# EAGLE design Badge Schematic (EAGLE 7.3.0)
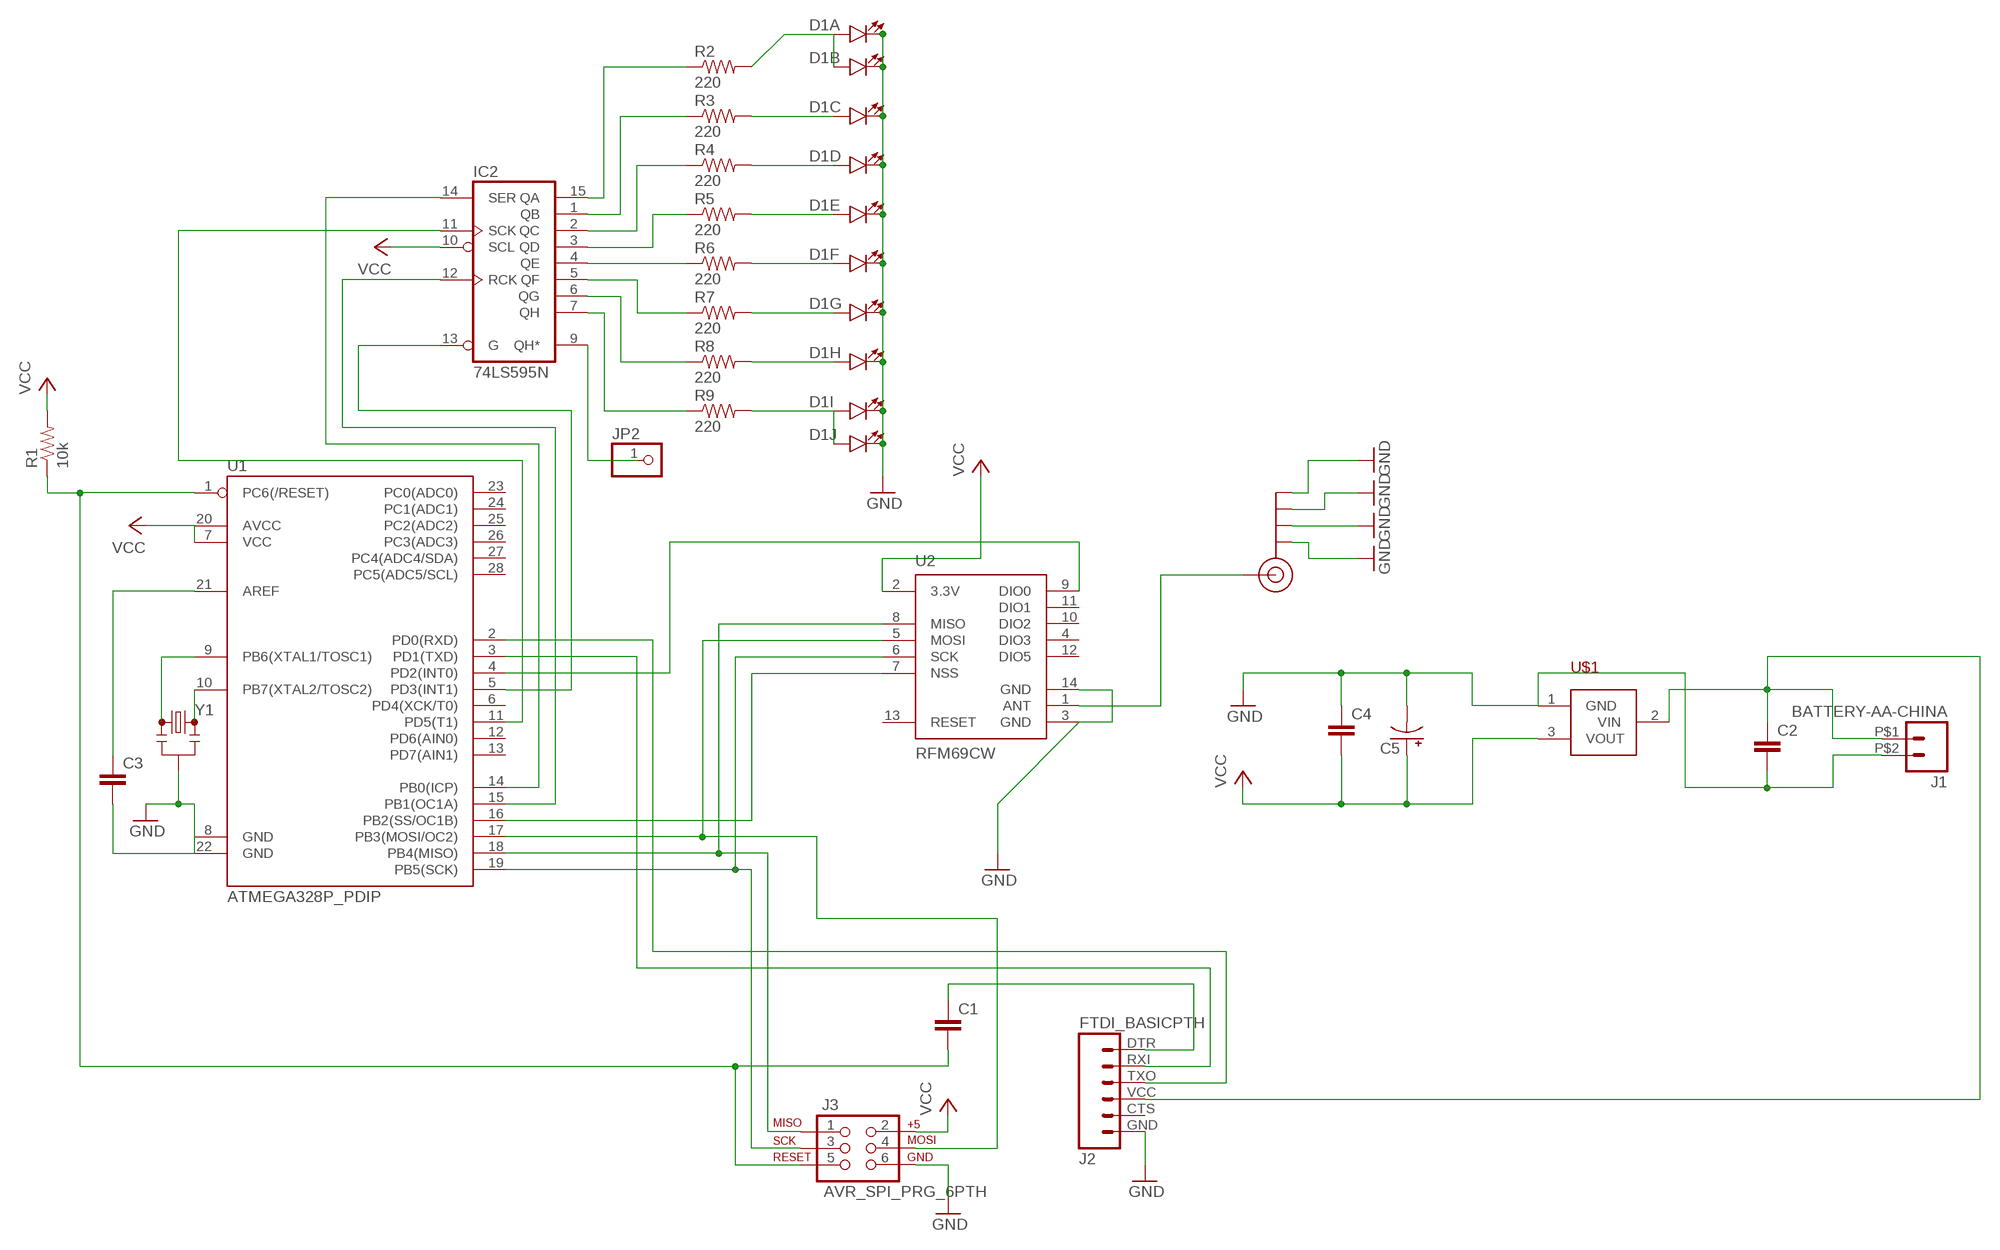
[diagram p0: schematic, sheet 1]

## Parts
C1  0.1UF-50V-20%(PTH)KIT-EZ  [CAP-PTH-SMALL-KIT]
C2  0.1UF-50V-20%(PTH)KIT-EZ  [CAP-PTH-SMALL-KIT]
C3  0.1UF-50V-20%(PTH)KIT-EZ  [CAP-PTH-SMALL-KIT]
C4  0.1UF-50V-20%(PTH)KIT-EZ  [CAP-PTH-SMALL-KIT]
C5  10UF-25V-20%(PTH)KIT  [CPOL-RADIAL-10UF-25V-KIT]
D1  LED_BARGRAPH_10  [LED_BARGAPH_10]
IC2  74LS595N  [DIL16]
J1  BATTERY-AA-CHINA  [BATTERY-AA-CHINA-PACKAGE]
J2  FTDI_BASICPTH  [FTDI_BASIC]
J3  AVR_SPI_PRG_6PTH  [2X3]
J$1  SMA_EDGE  [SMA-EDGE]
JP2  PINHD-1X1  [1X01]
R1  10k  RESISTORAXIAL-0.3  [AXIAL-0.3]
R2  220  RESISTOREZ  [AXIAL-0.3EZ]
R3  220  RESISTOREZ  [AXIAL-0.3EZ]
R4  220  RESISTOREZ  [AXIAL-0.3EZ]
R5  220  RESISTOREZ  [AXIAL-0.3EZ]
R6  220  RESISTOREZ  [AXIAL-0.3EZ]
R7  220  RESISTOREZ  [AXIAL-0.3EZ]
R8  220  RESISTOREZ  [AXIAL-0.3EZ]
R9  220  RESISTOREZ  [AXIAL-0.3EZ]
U1  ATMEGA328P_PDIP  [DIL28-3]
U2  RFM69CW  [RFM69CW-XXXS2]
U$1  MCP1702-33TO92  [TO-92]
Y1  RESONATORPTH  [RESONATOR-PTH]

## Nets
GND: C2.2 C3.2 C4.1 C5.2(-) D1.11(J:C) D1.12(I:C) D1.13(H:C) D1.14(G:C) D1.15(F:C) D1.16(E:C) D1.17(D:C) D1.18(C:C) D1.19(B:C) D1.20(A:C) J1.P$2 J2.GND J3.6 J$1.GND@0(GND) J$1.GND@1(GND) J$1.GND@2(GND) J$1.GND@3(GND) U1.8(GND) U1.22(GND) U2.3(GND) U2.14(GND) U$1.1(GND) Y1.2
N$1: J$1.SIG(SIGNAL) U2.1(ANT)
N$2: J3.4 U1.17(PB3(MOSI/OC2)) U2.5(MOSI)
N$3: J3.1 U1.18(PB4(MISO)) U2.8(MISO)
N$4: J3.3 U1.19(PB5(SCK)) U2.6(SCK)
N$5: U1.4(PD2(INT0)) U2.9(DIO0)
N$6: U1.16(PB2(SS/OC1B)) U2.7(NSS)
N$7: IC2.13(G) U1.5(PD3(INT1))
N$8: C1.1 J2.DTR
N$9: U1.10(PB7(XTAL2/TOSC2)) Y1.3
N$10: J2.TXO U1.2(PD0(RXD))
N$11: J2.RXI U1.3(PD1(TXD))
N$12: U1.9(PB6(XTAL1/TOSC1)) Y1.1
N$13: C2.1 J1.P$1 J2.VCC U$1.2(VIN)
N$14: IC2.7(QH) R9.P$1
N$15: IC2.15(QA) R2.P$1
N$16: IC2.6(QG) R8.P$1
N$17: IC2.5(QF) R7.P$1
N$18: C3.1 U1.21(AREF)
N$19: IC2.4(QE) R6.P$1
N$20: C1.2 J3.5 R1.P$1 U1.1(PC6(/RESET))
N$21: IC2.3(QD) R5.P$1
N$22: IC2.2(QC) R4.P$1
N$23: IC2.1(QB) R3.P$1
N$24: D1.1(A:A) D1.2(B:A) R2.P$2
N$25: D1.3(C:A) R3.P$2
N$26: D1.4(D:A) R4.P$2
N$27: D1.5(E:A) R5.P$2
N$28: D1.6(F:A) R6.P$2
N$29: D1.7(G:A) R7.P$2
N$30: D1.8(H:A) R8.P$2
N$31: D1.9(I:A) D1.10(J:A) R9.P$2
N$33: IC2.14(SER) U1.14(PB0(ICP))
N$34: IC2.12(RCK) U1.15(PB1(OC1A))
N$35: IC2.11(SCK) U1.11(PD5(T1))
N$36: IC2.9(QH*) JP2.1
VCC: C4.2 C5.1(+) IC2.10(SCL) J3.2 R1.P$2 U1.7(VCC) U1.20(AVCC) U2.2(3.3V) U$1.3(VOUT)
Unconnected: J2.CTS U1.6(PD4(XCK/T0)) U1.12(PD6(AIN0)) U1.13(PD7(AIN1)) U1.23(PC0(ADC0)) U1.24(PC1(ADC1)) U1.25(PC2(ADC2)) U1.26(PC3(ADC3)) U1.27(PC4(ADC4/SDA)) U1.28(PC5(ADC5/SCL)) U2.4(DIO3) U2.10(DIO2) U2.11(DIO1) U2.12(DIO5) U2.13(RESET)

## Power pins joined to a net without a drawn wire
GND: IC2.8(GND)
VCC: IC2.16(VCC)

## Library data of the parts
C1-C4 = SparkFun-Capacitors:0.1UF-50V-20%(PTH): CAP-08370; PROD_ID: CAP-08370
C5 = SparkFun-Capacitors:10UF-25V-20%(PTH): CAP-08440; PROD_ID: CAP-08440
D1 = SparkFun-LED:LED_BARGRAPH_10: 10-Segment LED Bar Graph SFE part numbers: COM-09935 (red, Vf = 2.1V, Ifmax = 20mA) COM-09936 (yellow, Vf = 2.1V, Ifmax = 20mA) COM-09937 (blue, Vf = 3.4V, Ifmax = 20mA) COM-09938 (green, Vf = 3.4V, Ifmax = 20mA)
IC2 = 74xx-us:74*595: 8-bit SHIFT REGISTER, output latch
J1 = CarolinaCon:BATTERY-AA-CHINA
J2 = SparkFun-Connectors:FTDI_BASIC: FTDI Basic header with labels
J3 = SparkFun-Connectors:AVR_SPI_PRG_6: AVR ISP 6 Pin This is the reduced ISP connector for AVR programming. Common on Arduino. This footprint will take up less PCB space and can be used with a 10-pin to 6-pin adapter such as SKU: BOB-08508 **Special note about "TEST_POINT" package. The stop mask is on the top side, so if you want your programming test points to be on the bottom of your board, make sure to place this package on the bottom side of the board. This also ensure that the orientation to program from the bottom side will be correct.
J$1 = SparkFun-Connectors:SMA_EDGE: SMA Antenna Connector End launch SMA connector. The paste layer has been removed so that the connector can be hand soldered onto the board after reflow.
JP2 = pinhead:PINHD-1X1: PIN HEADER
R1-R9 = SparkFun-Passives:RESISTOR: Resistor Basic schematic elements and footprints for 0603, 1206, and PTH resistors.
U1 = SparkFun-DigitalIC:ATMEGA328P_PDIP: uC used in the Arduino 32kb flash, 1k EEPROM, 2k SRAM This is the through-hole version of this chip.
U2 = SparkFun-RF:RFM69
U$1 = CarolinaCon:MCP1702-33
Y1 = SparkFun-FreqCtrl:RESONATOR: Resonator Small SMD resonator. Used, eg, on the Arduino Pro/ Pro Mini boards. 8MHz- XTAL-08895 16MHz- XTAL-08900

## Board
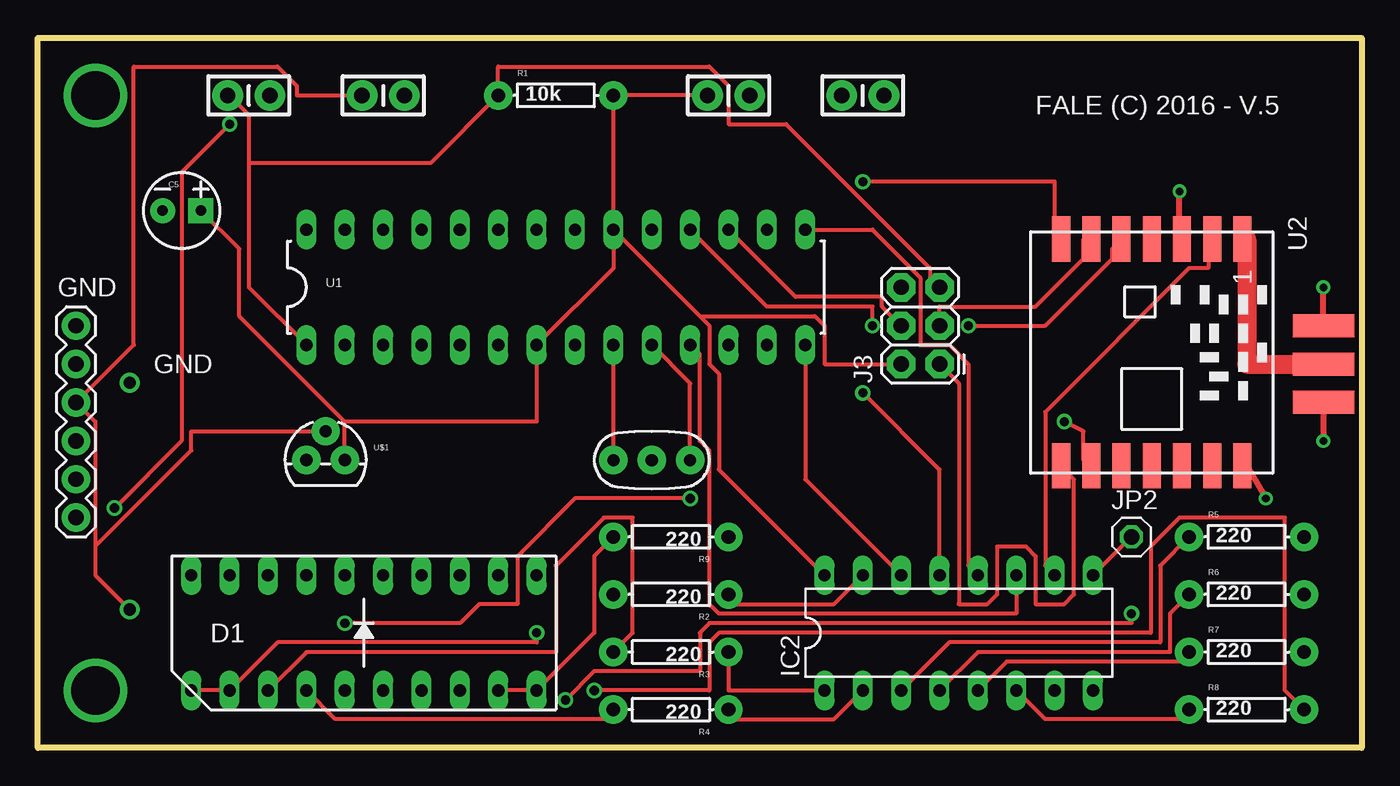
[diagram p1: board, top side]
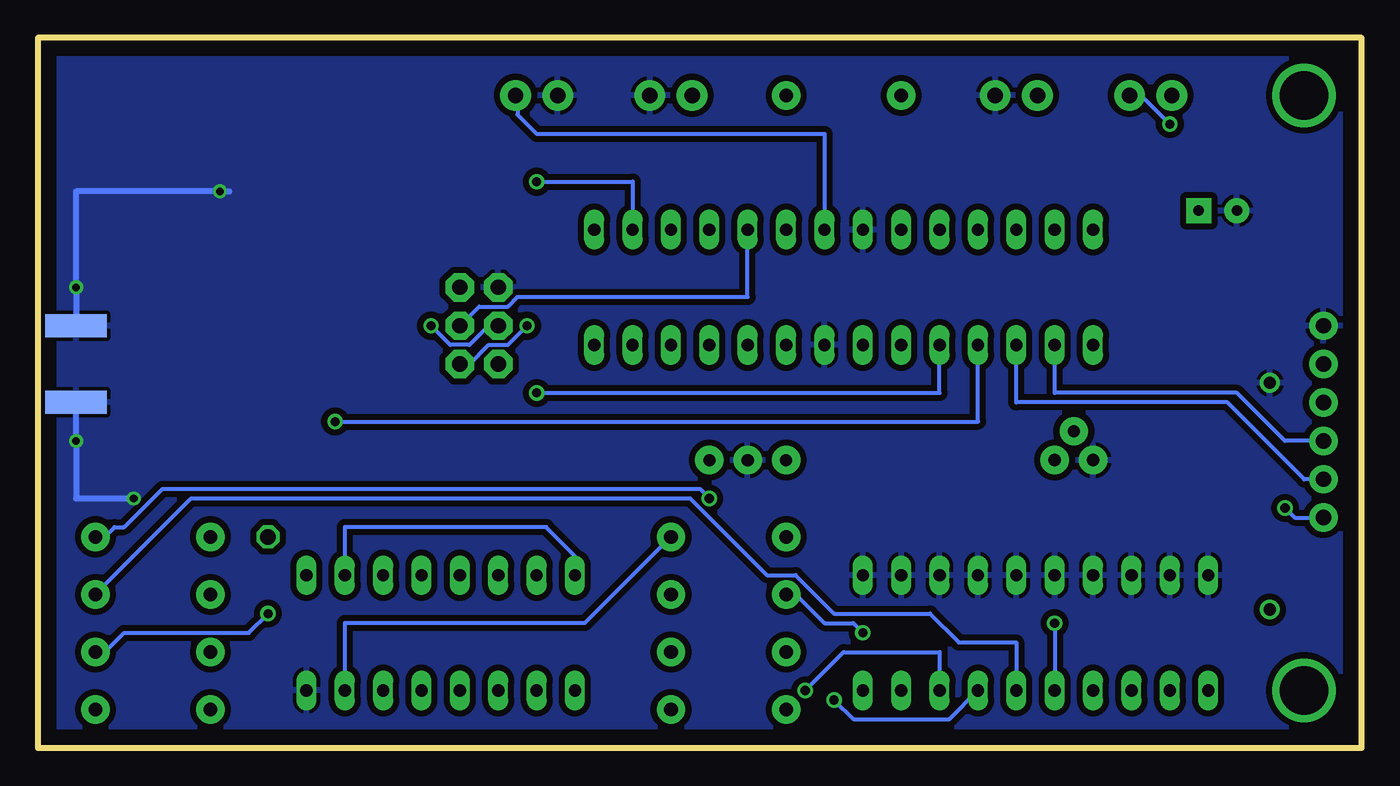
[diagram p2: board, bottom side, seen from below]

Size 87.63 x 46.99 mm. Coordinates in mm from the lower left corner, seen from the top.
Outline: 87.63,46.99 87.63,0 0,0 0,46.99 87.63,46.99
Copper layers (1*16): Top 0.035mm / dielectric 1.5mm / Bottom 0.035mm
Design rules "default": minimum track width 10mil, minimum drill 24mil, track to track 8mil, track to pad 8mil, pad to pad 8mil, via to via 8mil, smd to smd 8mil, copper to edge 40mil, drill to drill 8mil, minimum pad ring 10mil, minimum via ring 8mil, stop-mask expansion 4mil, vias tented up to drill 0mil, thermal gap 10mil

### Footprints (pad centres in the part's own frame; a part is rotated, then mirrored left to right if it is on the bottom)
CAP-PTH-SMALL-KIT = drill 1.016 pad 2.032: 1 -1.397,0; 2 1.397,0
CPOL-RADIAL-10UF-25V-KIT = drill 0.7 pad 1.651 square: 1 1.27,0 | drill 0.7 pad 1.651: 2 -1.27,0
LED_BARGAPH_10 = drill 0.813 long: 1 -11.43,-3.81; 2 -8.89,-3.81; 3 -6.35,-3.81; 4 -3.81,-3.81; 5 -1.27,-3.81; 6 1.27,-3.81; 7 3.81,-3.81; 8 6.35,-3.81; 9 8.89,-3.81; 10 11.43,-3.81; 11 11.43,3.81; 12 8.89,3.81; 13 6.35,3.81; 14 3.81,3.81; 15 1.27,3.81; 16 -1.27,3.81; 17 -3.81,3.81; 18 -6.35,3.81; 19 -8.89,3.81; 20 -11.43,3.81
DIL16 = drill 0.813 long: 1 -8.89,-3.81; 2 -6.35,-3.81; 3 -3.81,-3.81; 4 -1.27,-3.81; 5 1.27,-3.81; 6 3.81,-3.81; 7 6.35,-3.81; 8 8.89,-3.81; 9 8.89,3.81; 10 6.35,3.81; 11 3.81,3.81; 12 1.27,3.81; 13 -1.27,3.81; 14 -3.81,3.81; 15 -6.35,3.81; 16 -8.89,3.81
BATTERY-AA-CHINA-PACKAGE = drill 0.8: P$1 0,4; P$2 15,4
FTDI_BASIC = drill 1.016 pad 1.88: CTS 10.16,0; DTR 0,0; GND 12.7,0; RXI 2.54,0; TXO 5.08,0; VCC 7.62,0
2X3 = drill 1.016 pad 1.88 octagon: 1 0,0; 2 0,2.54; 3 2.54,0; 4 2.54,2.54; 5 5.08,0; 6 5.08,2.54
SMA-EDGE = smd 1.524 x 4.064: GND@0 0,0; GND@1 5.08,0; SIG 2.54,0 | smd 1.524 x 4.064 bottom: GND@2 0,0; GND@3 5.08,0
1X01 = drill 1.016 octagon: 1 0,0
AXIAL-0.3 = drill 0.9 pad 1.88: P$1 -3.81,0; P$2 3.81,0
AXIAL-0.3EZ = drill 0.9 pad 1.88: P$1 -3.81,0; P$2 3.81,0
DIL28-3 = drill 0.813 long: 1 -16.51,-3.81; 2 -13.97,-3.81; 3 -11.43,-3.81; 4 -8.89,-3.81; 5 -6.35,-3.81; 6 -3.81,-3.81; 7 -1.27,-3.81; 8 1.27,-3.81; 9 3.81,-3.81; 10 6.35,-3.81; 11 8.89,-3.81; 12 11.43,-3.81; 13 13.97,-3.81; 14 16.51,-3.81; 15 16.51,3.81; 16 13.97,3.81; 17 11.43,3.81; 18 8.89,3.81; 19 6.35,3.81; 20 3.81,3.81; 21 1.27,3.81; 22 -1.27,3.81; 23 -3.81,3.81; 24 -6.35,3.81; 25 -8.89,3.81; 26 -11.43,3.81; 27 -13.97,3.81; 28 -16.51,3.81
RFM69CW-XXXS2 = smd 3 x 1.2: 1 -7.5,6; 2 -7.5,4; 3 -7.5,2; 4 -7.5,0; 5 -7.5,-2; 6 -7.5,-4; 7 -7.5,-6; 8 7.5,-6; 9 7.5,-4; 10 7.5,-2; 11 7.5,0; 12 7.5,2; 13 7.5,4; 14 7.5,6
TO-92 = drill 0.813 pad 1.88: 1 -1.27,0; 2 0,1.905; 3 1.27,0
RESONATOR-PTH = drill 0.8 pad 1.88: 1 -2.54,0; 2 0,0; 3 2.54,0

### Placement (x,y rotation side)
C1  13.97,43.18 180 top
C2  22.86,43.18 0 top
C3  54.61,43.18 180 top
C4  45.72,43.18 180 top
C5  9.53,35.56 0 top
D1  21.59,7.62 0 top
IC2  60.96,7.62 0 top
J1  10.08,9.16 90 top
J2  2.54,15.24 90 top
J3  59.69,25.4 90 top
J$1  85.09,22.86 90 top
JP2  72.39,13.97 0 top
R1  34.29,43.18 0 top
R2  41.91,10.16 180 top
R3  41.91,6.35 180 top
R4  41.91,2.54 180 top
R5  80.01,13.97 0 top
R6  80.01,10.16 0 top
R7  80.01,6.35 0 top
R8  80.01,2.54 0 top
R9  41.91,13.97 180 top
U1  34.29,30.48 0 top
U2  73.73,26.17 270 top
U$1  19.05,19.05 0 top
Y1  40.64,19.05 0 top

### Tracks (layer width: path | path; a pad name or v marks a point on that pad's centre or on a via)
GND  (via drill 0.5)
  Top 0.406: U2.14 80.01,18.67 v81.28,16.51 | U2.3 75.56,33.67 v75.56,36.83 | J$1.GND@1 v85.09,30.48 | J$1.GND@0 v85.09,20.32
  Bottom 0.406: J$1.GND@0 v85.09,20.32 85.09,16.51 v81.28,16.51 | J$1.GND@1 v85.09,30.48 85.09,36.83 v75.56,36.83 74.93,36.83
  pour Bottom (isolate 0.406): 0,46.99 87.63,46.99 87.63,0 0,0
N$1
  Top 1.27: U2.1 80.01,33.67 80.01,25.4 J$1.SIG
N$2  (via drill 0.61)
  Top 0.254: U1.17 50.17,29.84 55.88,29.84 55.88,29.21 J3.4 | v61.59,27.94 66.67,27.94 71.12,32.38 71.12,33.02 71.75,33.66 U2.5
  Bottom 0.254: v61.59,27.94 60.33,26.67 59.05,26.67 57.78,27.94 J3.4
N$3  (via drill 0.61)
  Top 0.254: U1.18 48.26,29.21 55.24,29.21 v55.24,27.94 | J3.1 60.96,24.13 60.96,9.52 62.86,9.52 63.5,10.16 63.5,13.33 65.41,13.33 66.04,12.7 66.04,9.52 67.94,9.52 68.58,10.16 68.58,17.78 67.94,18.41 U2.8
  Bottom 0.254: v55.24,27.94 56.52,26.67 57.78,26.67 59.05,25.4 J3.1
N$4
  Top 0.254: J3.3 59.69,29.21 66.04,29.21 69.22,32.38 69.22,33.66 U2.6
  Bottom 0.254: U1.19 40.64,29.84 55.88,29.84 56.52,29.21 58.42,29.21 J3.3
N$5  (via drill 0.61)
  Top 0.254: v67.94,21.59 69.22,20.95 69.22,19.05 U2.9
  Top 0.406: U2.9 69.85,18.67
  Bottom 0.254: U1.4 25.4,21.59 v67.94,21.59
N$6  (via drill 0.61)
  Top 0.254: v54.61,37.46 67.31,37.46 67.31,34.29 U2.7
  Bottom 0.254: U1.16 48.26,37.46 v54.61,37.46
N$7  (via drill 0.61)
  Top 0.254: v54.61,23.49 59.69,18.41 IC2.13
  Bottom 0.254: U1.5 27.94,23.49 v54.61,23.49
N$8  (via drill 0.61)
  Top 0.254: v5.08,15.88 9.53,20.32 9.53,38.1 v12.7,41.27
  Bottom 0.254: J2.DTR 4.45,15.24 v5.08,15.88 | v12.7,41.27 14.61,43.18 C1.1
N$9
  Top 0.254: U1.10 43.18,24.13 Y1.3
N$10
  Bottom 0.254: U1.2 20.32,23.49 8.25,23.49 5.08,20.32 J2.TXO
N$11
  Bottom 0.254: U1.3 22.86,22.86 8.89,22.86 3.81,17.78 J2.RXI
N$12
  Top 0.254: Y1.1 U1.9
N$13
  Top 0.254: J1.P$1 3.81,11.43 3.81,13.33 | 3.81,13.33 3.81,21.59 J2.VCC 6.35,26.67 6.35,45.09 15.88,45.09 17.14,43.81 17.14,43.18 C2.1 | U$1.2 10.16,20.95 10.16,19.69 3.81,13.33
N$14
  Bottom 0.254: IC2.7 67.31,8.25 51.44,8.25 46.36,13.33 46.36,13.97 R9.P$1
N$15
  Top 0.254: IC2.15 52.7,9.52 45.72,9.52 R2.P$1
N$16
  Top 0.254: IC2.6 66.67,1.9 76.2,1.9 R8.P$1
N$17
  Top 0.254: IC2.5 64.13,5.71 76.2,5.71 R7.P$1
N$18
  Bottom 0.254: U1.21 35.56,40.64 54.61,40.64 55.88,41.91 55.88,43.18 C3.1
N$19
  Top 0.254: IC2.4 62.23,6.35 74.93,6.35 74.93,8.89 R6.P$1
N$20
  Top 0.254: U1.1 13.97,30.48 13.97,38.73 | 13.97,38.73 13.97,41.91 12.7,43.18 C1.2 | 13.97,38.73 26.04,38.73 R1.P$1 30.48,45.09 44.45,45.09 45.72,43.81 45.72,41.27 49.53,41.27 59.05,31.75 59.05,31.12 J3.5
N$21
  Top 0.254: IC2.3 60.33,6.98 74.3,6.98 74.3,12.06 R5.P$1
N$22
  Top 0.254: IC2.2 52.7,1.9 45.72,1.9 R4.P$1
N$23
  Top 0.254: IC2.1 45.72,3.81 R3.P$1
N$24  (via drill 0.61)
  Top 0.254: D1.1 D1.2 15.88,6.98 33.02,6.98 v33.02,7.62
  Bottom 0.254: v33.02,7.62 33.66,8.25 35.56,8.25 37.47,10.16 R2.P$2
N$25
  Top 0.254: D1.3 17.78,6.35 34.29,6.35 34.29,12.06 37.47,15.24 39.37,15.24 39.37,7.62 R3.P$2
N$26
  Top 0.254: D1.4 19.68,1.9 38.1,1.9 R4.P$2
N$27  (via drill 0.61)
  Top 0.254: v20.32,8.25 27.94,8.25 29.21,9.52 31.75,9.52 31.75,12.7 35.56,16.51 v43.18,16.51
  Bottom 0.254: v20.32,8.25 D1.5 | v43.18,16.51 43.81,17.14 79.38,17.14 81.91,14.6 82.55,14.6 83.19,13.97 R5.P$2
N$28
  Bottom 0.254: D1.6 22.86,6.98 26.67,6.98 28.57,8.89 34.92,8.89 37.47,11.43 39.37,11.43 44.45,16.51 77.47,16.51 83.19,10.79 83.19,10.16 R6.P$2
N$29  (via drill 0.61)
  Top 0.254: v34.92,3.17 36.83,5.08 43.81,5.08 43.81,7.62 44.45,8.25 72.39,8.25 v72.39,8.89
  Bottom 0.254: D1.7 27.31,1.9 33.66,1.9 v34.92,3.17 | v72.39,8.89 73.66,7.62 81.91,7.62 83.19,6.35 R7.P$2
N$30  (via drill 0.61)
  Top 0.254: v36.83,3.81 44.45,3.81 44.45,6.98 45.08,7.62 73.66,7.62 73.66,13.33 75.56,15.24 82.55,15.24 82.55,3.81 R8.P$2
  Bottom 0.254: D1.8 27.94,6.35 34.29,6.35 v36.83,3.81
N$31
  Top 0.254: D1.9 D1.10 36.83,7.62 36.83,12.7 R9.P$2
N$32  (via drill 3.2)
  other vias: 3.81,43.18
N$33
  Top 0.254: IC2.14 50.8,17.78 U1.14
N$34
  Top 0.254: IC2.12 61.59,12.06 61.59,25.4 60.33,26.67 58.42,26.67 58.42,31.12 55.24,34.29 U1.15
N$35
  Top 0.254: U1.11 43.81,26.03 43.81,20.32 44.45,19.69 44.45,9.52 45.08,8.89 64.77,8.89 IC2.11
N$36
  Top 0.254: JP2.1 IC2.9
N$37  (via drill 3.2)
  other vias: 3.81,3.81
VCC
  Top 0.254: IC2.10 66.67,12.06 66.67,22.23 76.2,31.75 77.47,31.75 77.47,33.66 U2.2 | C5.1 13.34,33.02 13.34,28.57 20.32,21.59 | U$1.3 20.32,21.59 | C4.2 R1.P$2 U1.20 | U1.20 38.1,31.75 U1.7 33.02,21.59 20.32,21.59 | IC2.16 45.08,18.41 45.08,24.77 44.45,25.4 44.45,27.94 43.81,28.57 | U1.20 43.81,28.57 | J3.2 52.07,25.4 52.07,27.94 51.44,28.57 43.81,28.57
  Top 0.406: U2.2 77.47,33.67
  Bottom 0.254: IC2.10 67.31,14.6 53.97,14.6 52.07,12.7 IC2.16

### Text on the board
tPlace: FALE (C) 2016 - V.5 | GND | GND